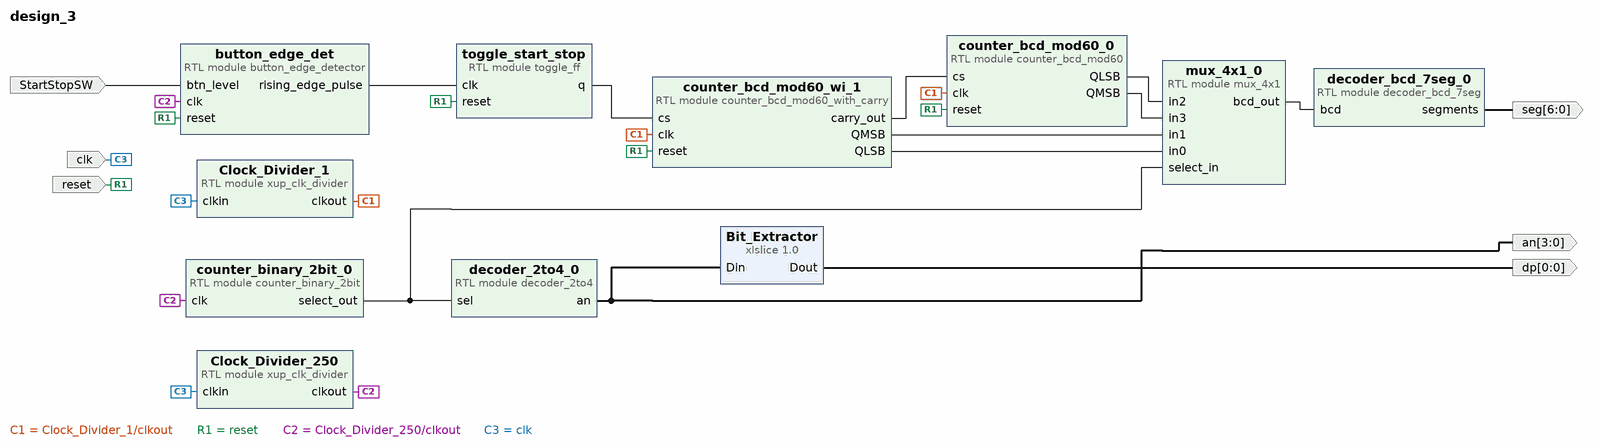
[diagram p0: block diagram of the top level]
# Vivado block design design_3, xc7a35tcpg236-1, Vivado 2018.3
create_bd_design design_3

create_bd_port -dir I clk
create_bd_port -dir I reset
create_bd_port -dir O -from 0 -to 0 dp
create_bd_port -dir O -from 6 -to 0 seg
create_bd_port -dir O -from 3 -to 0 an
create_bd_port -dir I StartStopSW

create_bd_cell -type module -reference counter_bcd_mod60 counter_bcd_mod60_0
create_bd_cell -type module -reference counter_binary_2bit counter_binary_2bit_0
create_bd_cell -type module -reference mux_4x1 mux_4x1_0
create_bd_cell -type module -reference decoder_bcd_7seg decoder_bcd_7seg_0
create_bd_cell -type module -reference decoder_2to4 decoder_2to4_0
create_bd_cell -type module -reference xup_clk_divider Clock_Divider_250
set_property -dict {CONFIG.SIZE 400000} [get_bd_cells Clock_Divider_250]
create_bd_cell -type module -reference xup_clk_divider Clock_Divider_1
set_property -dict {CONFIG.SIZE 100000000} [get_bd_cells Clock_Divider_1]
create_bd_cell -type ip -vlnv xilinx.com:ip:xlslice:1.0 Bit_Extractor
set_property -dict {CONFIG.DIN_FROM 2 CONFIG.DIN_TO 2 CONFIG.DIN_WIDTH 4 CONFIG.DOUT_WIDTH 1} [get_bd_cells Bit_Extractor]
create_bd_cell -type module -reference button_edge_detector button_edge_det
create_bd_cell -type module -reference toggle_ff toggle_start_stop
create_bd_cell -type module -reference counter_bcd_mod60_with_carry counter_bcd_mod60_wi_1

# ---- connections ----

connect_bd_net -net Clock_Divider_100_clkout [get_bd_pins Clock_Divider_1/clkout] \
  [get_bd_pins counter_bcd_mod60_0/clk] [get_bd_pins counter_bcd_mod60_wi_1/clk]
connect_bd_net [get_bd_ports reset] \
  [get_bd_pins counter_bcd_mod60_0/reset] [get_bd_pins button_edge_det/reset] [get_bd_pins toggle_start_stop/reset] \
  [get_bd_pins counter_bcd_mod60_wi_1/reset]
connect_bd_net [get_bd_pins counter_binary_2bit_0/select_out] [get_bd_pins mux_4x1_0/select_in] [get_bd_pins decoder_2to4_0/sel]
connect_bd_net [get_bd_pins Clock_Divider_250/clkout] [get_bd_pins counter_binary_2bit_0/clk] [get_bd_pins button_edge_det/clk]
connect_bd_net [get_bd_pins decoder_2to4_0/an] [get_bd_ports an] [get_bd_pins Bit_Extractor/Din]
connect_bd_net [get_bd_pins Bit_Extractor/Dout] [get_bd_ports dp]
connect_bd_net [get_bd_pins decoder_bcd_7seg_0/segments] [get_bd_ports seg]
connect_bd_net [get_bd_pins counter_bcd_mod60_0/QLSB] [get_bd_pins mux_4x1_0/in2]
connect_bd_net [get_bd_pins counter_bcd_mod60_0/QMSB] [get_bd_pins mux_4x1_0/in3]
connect_bd_net [get_bd_pins mux_4x1_0/bcd_out] [get_bd_pins decoder_bcd_7seg_0/bcd]
connect_bd_net [get_bd_ports clk] [get_bd_pins Clock_Divider_1/clkin] [get_bd_pins Clock_Divider_250/clkin]
connect_bd_net [get_bd_pins button_edge_det/rising_edge_pulse] [get_bd_pins toggle_start_stop/clk]
connect_bd_net [get_bd_pins counter_bcd_mod60_wi_1/carry_out] [get_bd_pins counter_bcd_mod60_0/cs]
connect_bd_net [get_bd_pins counter_bcd_mod60_wi_1/QMSB] [get_bd_pins mux_4x1_0/in1]
connect_bd_net [get_bd_pins counter_bcd_mod60_wi_1/QLSB] [get_bd_pins mux_4x1_0/in0]
connect_bd_net [get_bd_ports StartStopSW] [get_bd_pins button_edge_det/btn_level]
connect_bd_net [get_bd_pins toggle_start_stop/q] [get_bd_pins counter_bcd_mod60_wi_1/cs]

validate_bd_design
save_bd_design
